# EAGLE design Board (EAGLE 7.7.0)
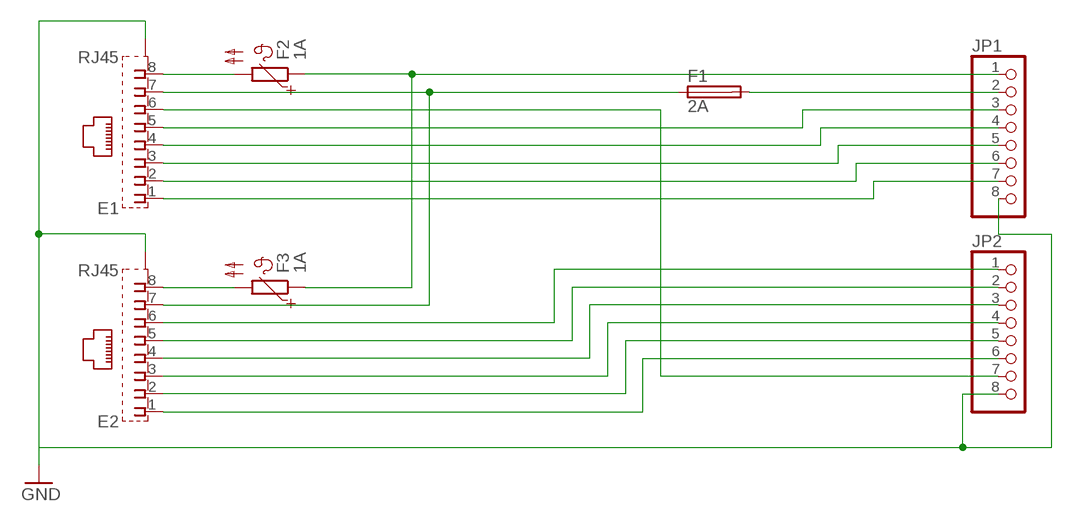
[diagram p0: schematic, sheet 1]

## Parts
E1  RJ45  [RJ45]
E2  RJ45  [RJ45]
F1  2A  SH22,5A  [SH22,5A]
F2  1A  POLYFUSE  [POLYFUSE]
F3  1A  POLYFUSE  [POLYFUSE]
JP1  PINHD-1X8  [1X08]
JP2  PINHD-1X8  [1X08]

## Nets
GND [Power]: E1.S@1(S) E1.S@2(S) E2.S@1(S) E2.S@2(S) JP1.8 JP2.8
N$1 [Power]: E1.8 F2.2
N$2 [Power]: E2.8 F3.2
N$3 [Power]: E1.7 E2.7 F1.1
N$4 [High_Current]: F2.1 F3.1 JP1.1
N$5 [High_Current]: F1.2 JP1.2
N$6: E1.1 JP1.7
N$7: E1.2 JP1.6
N$8 [Power]: E1.3 JP1.5
N$9 [Power]: E1.4 JP1.4
N$10 [Power]: E1.5 JP1.3
N$11 [Power]: E1.6 JP2.7
N$13 [Power]: E2.1 JP2.6
N$14 [Power]: E2.2 JP2.5
N$15: E2.3 JP2.4
N$16: E2.4 JP2.3
N$17 [Power]: E2.5 JP2.2
N$18 [Power]: E2.6 JP2.1

## Library data of the parts
E1 E2 = bardiir:RJ45
F1 = fuse:SH22,5A: FUSE HOLDER grid 22,5mm, isolated cap OGN0031 8201, Schurter (Buerklin); MPN: 0031.7701.11; OC_FARNELL: unknown; OC_NEWARK: 04F1224
F2 F3 = bardiir:POLYFUSE
JP1 JP2 = pinhead:PINHD-1X8: PIN HEADER

## Net classes
1 High_Current: width 1.5 mm
2 Power: width 1 mm

## Board
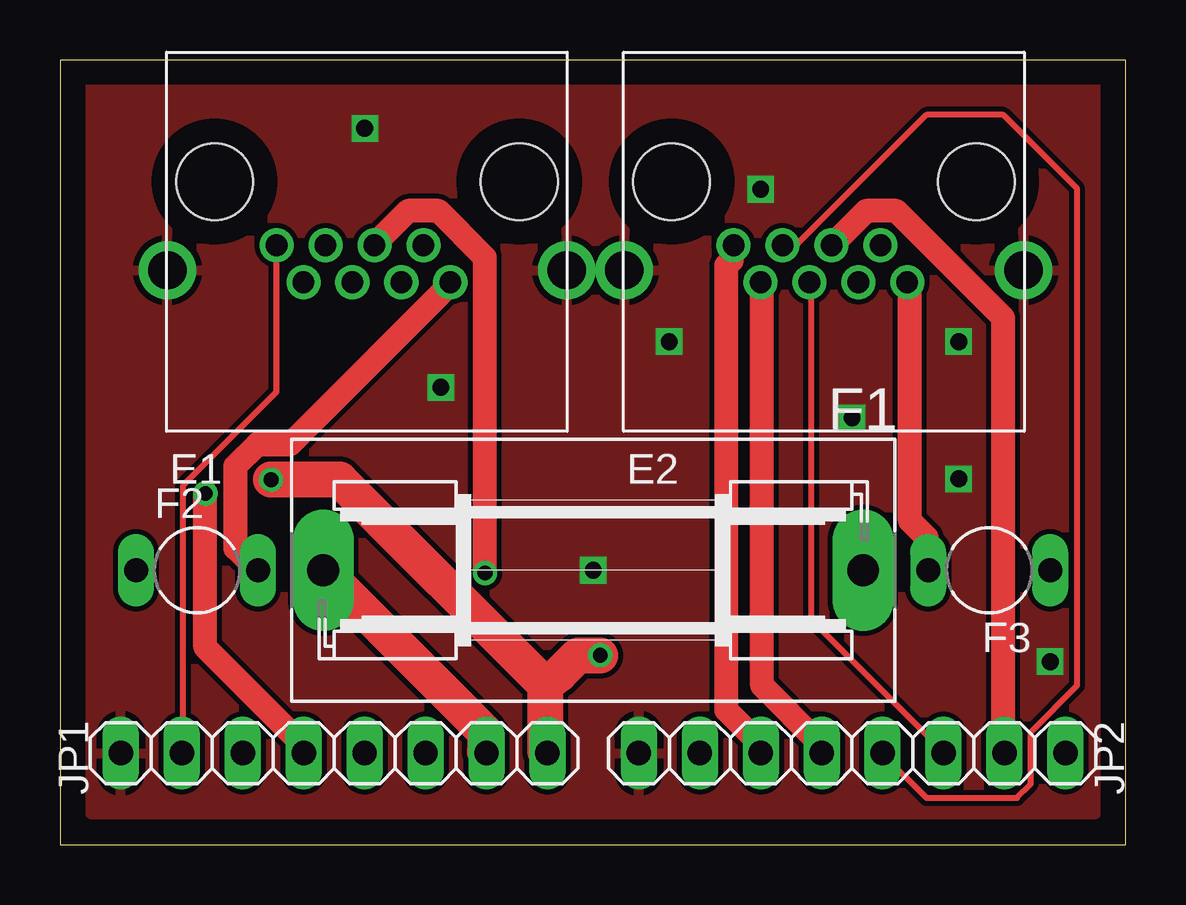
[diagram p1: board, top side]
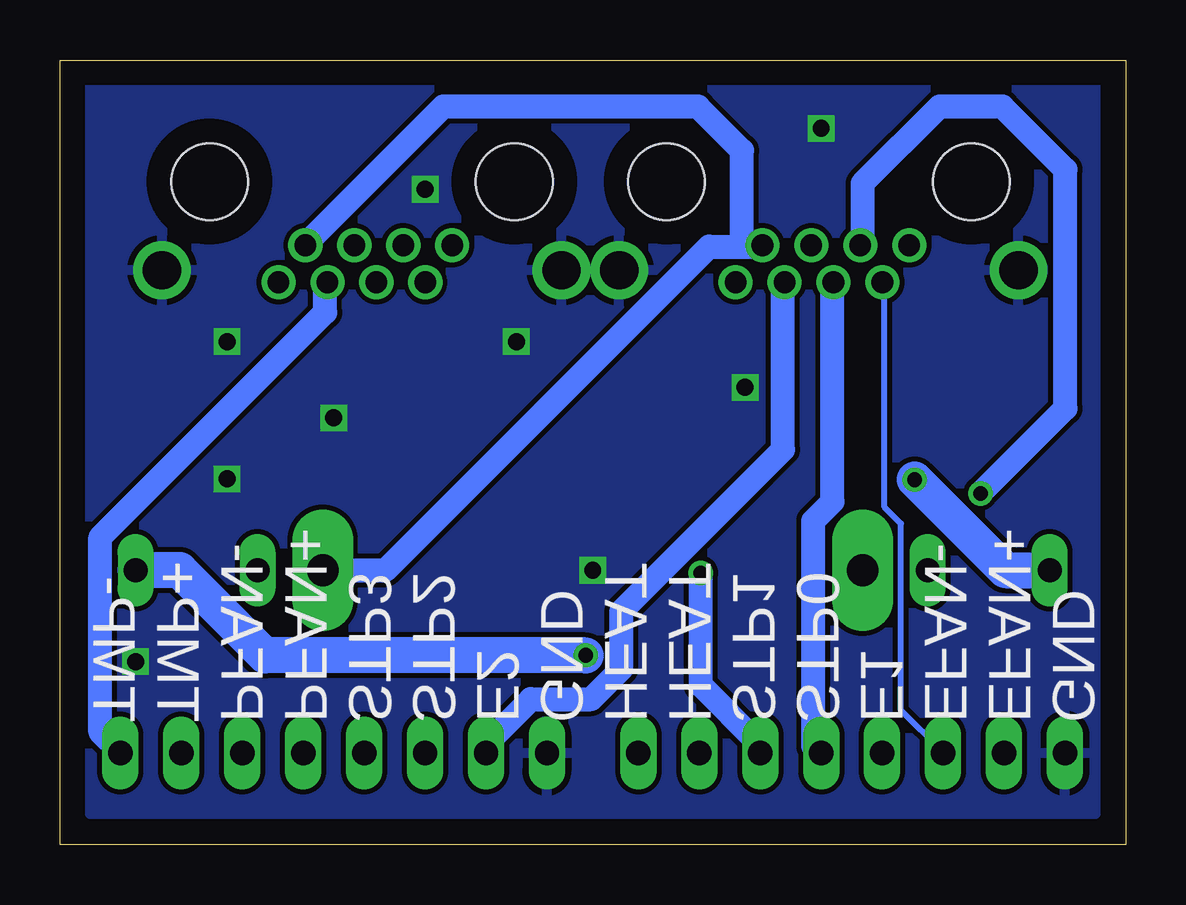
[diagram p2: board, bottom side, seen from below]

Size 44.43 x 32.69 mm. Coordinates in mm from the lower left corner, seen from the top.
Outline: 0,0 44.43,0 44.43,32.69 0,32.69 0,0
Copper layers (1*16): Top 0.035mm / dielectric 1.5mm / Bottom 0.035mm
Design rules "default": minimum track width 10mil, minimum drill 24mil, track to track 8mil, track to pad 8mil, pad to pad 8mil, via to via 8mil, smd to smd 8mil, copper to edge 40mil, drill to drill 8mil, minimum pad ring 10mil, minimum via ring 8mil, stop-mask expansion 4mil, vias tented up to drill 0mil, thermal gap 10mil

### Footprints (pad centres in the part's own frame; a part is rotated, then mirrored left to right if it is on the bottom)
RJ45 = drill 0.9 pad 1.422: 1 4.585,-8.05; 2 5.705,-9.59; 3 6.625,-8.05; 4 7.745,-9.59; 5 8.665,-8.05; 6 9.785,-9.59; 7 10.705,-8.05; 8 11.825,-9.59 | drill 1.6 pad 2.184: S@1 0.03,-9.09; S@2 16.68,-9.09 | hole 3.2: 2,-5.4; 14.7,-5.4
SH22,5A = drill 1.321 pad 2.54 long: 1 -11.252,0; 2 11.252,0
POLYFUSE = drill 1 long: 1 -2.54,0; 2 2.54,0
1X08 = drill 1.016 long: 1 -8.89,0; 2 -6.35,0; 3 -3.81,0; 4 -1.27,0; 5 1.27,0; 6 3.81,0; 7 6.35,0; 8 8.89,0

### Placement (x,y rotation side)
E1  4.45,33.02 0 top
E2  23.5,33.02 0 top
F1  22.23,11.43 180 top
F2  5.71,11.43 0 top
F3  38.73,11.43 180 top
JP1  11.43,3.81 180 top
JP2  33.02,3.81 180 top

### Tracks (layer width: path | path; a pad name or v marks a point on that pad's centre or on a via)
GND  (via drill 0.7)
  Top 1: E2.S@2 40.12,24 39.98,24.13
  other vias: 25.4,20.95 37.47,15.24 37.47,20.95 22.23,11.43 15.88,19.05 12.7,29.84 33.02,17.78 29.21,27.3 41.27,7.62
  pour Bottom: 1.27,31.75 1.27,1.27 43.18,1.27 43.18,31.75
  pour Top: 1.27,31.75 1.27,1.27 43.18,1.27 43.18,31.75
N$1
  Top 1: E1.8 16.23,23.32 9.6,16.69 8.23,16.69 7.32,15.77 7.32,12.34 8.23,11.43 F2.2
N$2
  Top 1: E2.8 35.43,23.32 35.43,13.49 36.12,12.8 36.12,11.43 F3.2
N$3
  Bottom 1: 16,24.92 17.37,24.92 30.86,11.43 F1.1 | 16,24.92 15.2,24.92 E1.7 | 16,24.92 16,28.92 17.83,30.75 28.46,30.75 34.18,25.03 E2.7
N$4  (via drill 0.61)
  Top 1.5: v8.8,15.2 11.66,15.2 20.23,6.63 | 20.23,6.63 20.23,3.89 JP1.1 | v22.52,7.89 21.6,7.89 20.8,7.09 20.23,6.63
  Bottom 1.5: F2.1 5.03,11.43 v8.8,15.2 | F3.1 39.43,11.43 35.89,7.89 v22.52,7.89
N$5
  Top 1.5: F1.2 17.72,4.69 17.72,3.89 JP1.2
N$6
  Top 0.254: E1.1 9.03,24.92 9.03,18.86 5.14,14.97 5.14,3.89 JP1.7
N$7
  Bottom 0.254: E1.2 10.06,23.32 10.06,14.06 9.37,13.37 9.37,5.6 7.66,3.89 JP1.6
N$8  (via drill 0.61)
  Top 1: v6.06,14.63 6.06,8.23 10.06,4.23 10.06,3.89 JP1.5
  Bottom 1: v6.06,14.63 2.52,18.17 2.52,28.12 5.14,30.75 7.77,30.75 10.97,27.55 10.97,25.03 E1.3
N$9
  Bottom 1: E1.4 12.23,23.32 12.23,14.29 13.03,13.49 13.03,4.12 12.8,3.89 JP1.4
N$10  (via drill 0.61)
  Top 1: v17.72,11.32 17.72,24.46 15.77,26.4 14.52,26.4 13.14,25.03 E1.5
  Bottom 1: v17.72,11.32 17.72,6.63 15.32,4.23 15.32,3.89 JP1.3
N$11
  Bottom 1: E1.6 14.29,23.32 14.29,16.46 21.03,9.72 21.03,7.32 22.29,6.06 24.8,6.06 26.63,4.23 26.63,3.89 JP2.7
N$13
  Top 1: E2.1 28,24.92 28,24.35 27.77,24.12 27.77,5.6 29.15,4.23 29.15,3.89 JP2.6
N$14
  Top 1: E2.2 29.26,23.32 29.26,6.63 31.66,4.23 31.66,3.89 JP2.5
N$15
  Top 0.254: E2.3 30.18,25.03 30.75,25.03 36.12,30.4 39.32,30.4 42.41,27.32 42.41,6.63 40.46,4.69 40.46,2.52 39.89,1.94 36.12,1.94 34.29,3.77 JP2.4
N$16
  Top 0.254: E2.4 31.32,23.32 31.32,9.37 36.8,3.89 JP2.3
N$17
  Top 1: E2.5 32.23,25.03 33.6,26.4 34.86,26.4 39.32,21.95 39.32,3.89 JP2.2
N$18
  Bottom 1: E2.6 33.38,23.32 33.38,22.17 42.75,12.8 42.75,4.69 41.95,3.89 JP2.1

### Text on the board
bNames: GND / EFAN+ / EFAN- / E1 / STP0 / STP1 / HEAT / HEAT / GND / E2 / STP2 / STP3 / PFAN+ / PFAN- / TMP+ / TMP-